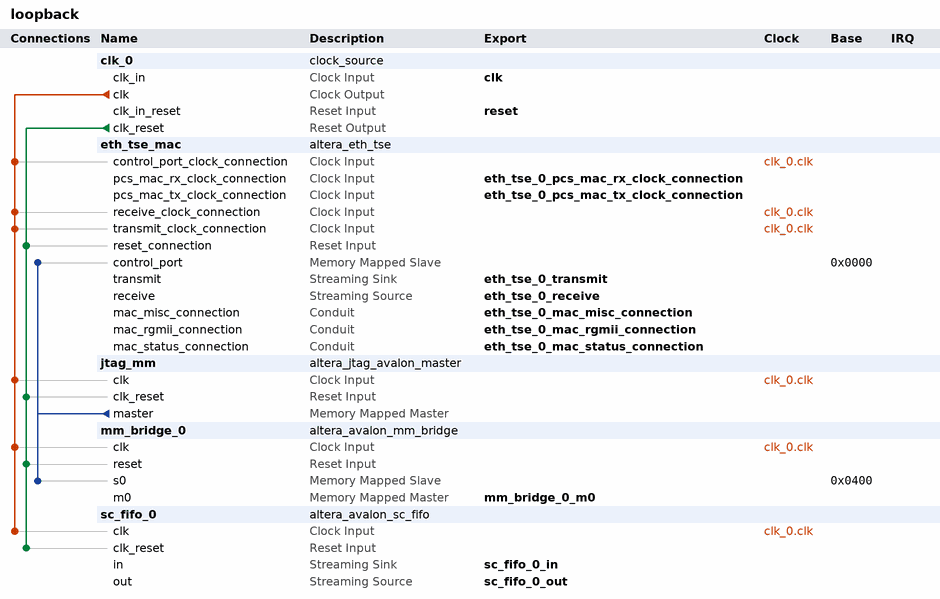
[diagram p0: system contents]
# Platform Designer (Qsys) system loopback, Cyclone V 5CEBA2F17A7
# Parameters at their usual value, and those the tool derives, are not listed.
package require -exact qsys 19.1
create_system loopback
set_project_property DEVICE_FAMILY {Cyclone V}
set_project_property DEVICE 5CEBA2F17A7

add_instance clk_0 clock_source 19.1
set_instance_parameter_value clk_0 clockFrequency 50000000

add_instance eth_tse_mac altera_eth_tse 19.1
set_instance_parameter_value eth_tse_mac XCVR_RCFG_JTAG_ENABLE 0
set_instance_parameter_value eth_tse_mac XCVR_SET_CAPABILITY_REG_ENABLE 0
set_instance_parameter_value eth_tse_mac XCVR_SET_CSR_SOFT_LOGIC_ENABLE 0
set_instance_parameter_value eth_tse_mac XCVR_SET_PRBS_SOFT_LOGIC_ENABLE 0
set_instance_parameter_value eth_tse_mac XCVR_SET_USER_IDENTIFIER 0
set_instance_parameter_value eth_tse_mac core_variation MAC_ONLY
set_instance_parameter_value eth_tse_mac enable_hd_logic true
set_instance_parameter_value eth_tse_mac enable_mac_flow_ctrl false
set_instance_parameter_value eth_tse_mac enable_magic_detect false
set_instance_parameter_value eth_tse_mac enable_shift16 true
set_instance_parameter_value eth_tse_mac ifGMII RGMII
set_instance_parameter_value eth_tse_mac ing_addr 11
set_instance_parameter_value eth_tse_mac mdio_clk_div 40
set_instance_parameter_value eth_tse_mac stat_cnt_ena true
set_instance_parameter_value eth_tse_mac transceiver_type NONE
set_instance_parameter_value eth_tse_mac useMDIO false

add_instance jtag_mm altera_jtag_avalon_master 19.1

add_instance mm_bridge_0 altera_avalon_mm_bridge 19.1
set_instance_parameter_value mm_bridge_0 ADDRESS_UNITS SYMBOLS
set_instance_parameter_value mm_bridge_0 ADDRESS_WIDTH 10
set_instance_parameter_value mm_bridge_0 DATA_WIDTH 32
set_instance_parameter_value mm_bridge_0 MAX_PENDING_RESPONSES 4
set_instance_parameter_value mm_bridge_0 USE_AUTO_ADDRESS_WIDTH 1

add_instance sc_fifo_0 altera_avalon_sc_fifo 19.1
set_instance_parameter_value sc_fifo_0 BITS_PER_SYMBOL 8
set_instance_parameter_value sc_fifo_0 CHANNEL_WIDTH 0
set_instance_parameter_value sc_fifo_0 ERROR_WIDTH 0
set_instance_parameter_value sc_fifo_0 FIFO_DEPTH 16
set_instance_parameter_value sc_fifo_0 SYMBOLS_PER_BEAT 4
set_instance_parameter_value sc_fifo_0 USE_FILL_LEVEL 0
set_instance_parameter_value sc_fifo_0 USE_MEMORY_BLOCKS 1
set_instance_parameter_value sc_fifo_0 USE_PACKETS 1
set_instance_parameter_value sc_fifo_0 USE_STORE_FORWARD 0

# connections
add_connection clk_0.clk eth_tse_mac.control_port_clock_connection clock
add_connection clk_0.clk eth_tse_mac.receive_clock_connection clock
add_connection clk_0.clk eth_tse_mac.transmit_clock_connection clock
add_connection clk_0.clk jtag_mm.clk clock
add_connection clk_0.clk mm_bridge_0.clk clock
add_connection clk_0.clk sc_fifo_0.clk clock
add_connection clk_0.clk_reset eth_tse_mac.reset_connection reset
add_connection clk_0.clk_reset jtag_mm.clk_reset reset
add_connection clk_0.clk_reset mm_bridge_0.reset reset
add_connection clk_0.clk_reset sc_fifo_0.clk_reset reset
add_connection jtag_mm.master eth_tse_mac.control_port avalon
set_connection_parameter_value jtag_mm.master/eth_tse_mac.control_port baseAddress 0x0000
add_connection jtag_mm.master mm_bridge_0.s0 avalon
set_connection_parameter_value jtag_mm.master/mm_bridge_0.s0 baseAddress 0x0400

# exported interfaces
add_interface clk clock sink
set_interface_property clk EXPORT_OF clk_0.clk_in
add_interface eth_tse_0_mac_misc_connection conduit end
set_interface_property eth_tse_0_mac_misc_connection EXPORT_OF eth_tse_mac.mac_misc_connection
add_interface eth_tse_0_mac_rgmii_connection conduit end
set_interface_property eth_tse_0_mac_rgmii_connection EXPORT_OF eth_tse_mac.mac_rgmii_connection
add_interface eth_tse_0_mac_status_connection conduit end
set_interface_property eth_tse_0_mac_status_connection EXPORT_OF eth_tse_mac.mac_status_connection
add_interface eth_tse_0_pcs_mac_rx_clock_connection clock sink
set_interface_property eth_tse_0_pcs_mac_rx_clock_connection EXPORT_OF eth_tse_mac.pcs_mac_rx_clock_connection
add_interface eth_tse_0_pcs_mac_tx_clock_connection clock sink
set_interface_property eth_tse_0_pcs_mac_tx_clock_connection EXPORT_OF eth_tse_mac.pcs_mac_tx_clock_connection
add_interface eth_tse_0_receive avalon_streaming source
set_interface_property eth_tse_0_receive EXPORT_OF eth_tse_mac.receive
add_interface eth_tse_0_transmit avalon_streaming sink
set_interface_property eth_tse_0_transmit EXPORT_OF eth_tse_mac.transmit
add_interface mm_bridge_0_m0 avalon master
set_interface_property mm_bridge_0_m0 EXPORT_OF mm_bridge_0.m0
add_interface reset reset sink
set_interface_property reset EXPORT_OF clk_0.clk_in_reset
add_interface sc_fifo_0_in avalon_streaming sink
set_interface_property sc_fifo_0_in EXPORT_OF sc_fifo_0.in
add_interface sc_fifo_0_out avalon_streaming source
set_interface_property sc_fifo_0_out EXPORT_OF sc_fifo_0.out

set_interconnect_requirement {$system} qsys_mm.clockCrossingAdapter HANDSHAKE
set_interconnect_requirement {$system} qsys_mm.enableEccProtection FALSE
set_interconnect_requirement {$system} qsys_mm.insertDefaultSlave FALSE
set_interconnect_requirement {$system} qsys_mm.maxAdditionalLatency 1

save_system loopback.qsys
